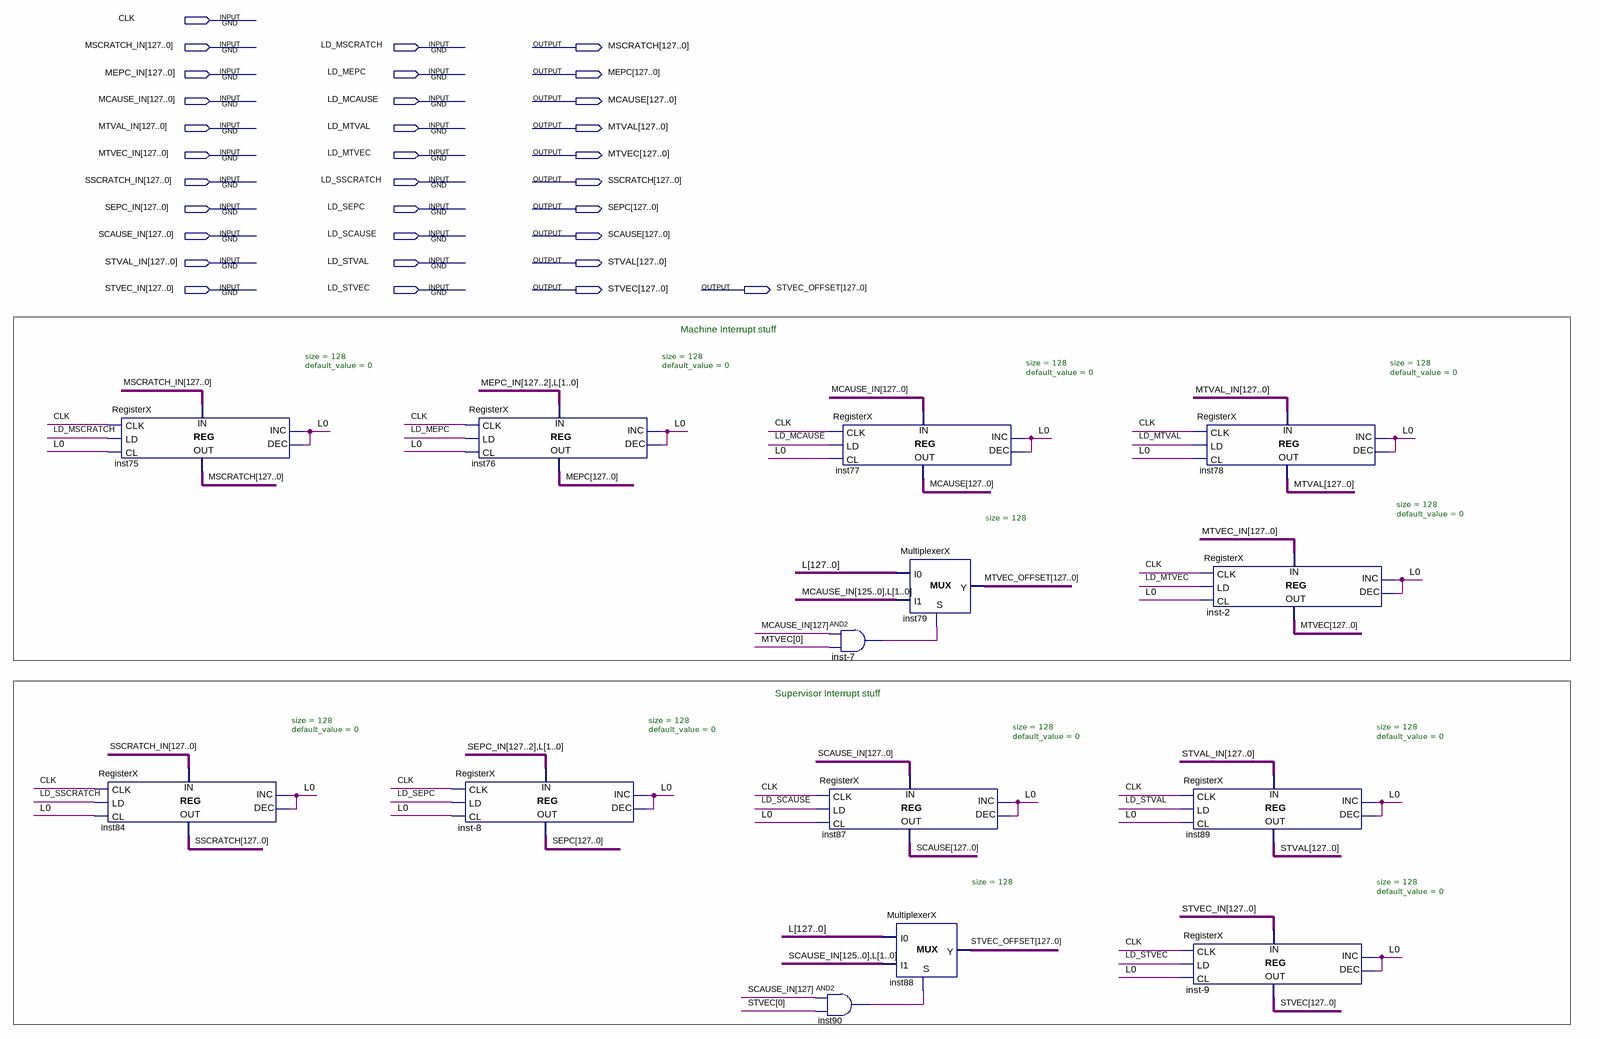
[diagram p0: schematic sheet]
// Quartus schematic Core_IntStatus.bdf as structural Verilog: 14 symbols, 32 pins
module Core_IntStatus (
  input  CLK,
  input  [127:0] MSCRATCH_IN,
  input  LD_MSCRATCH,
  input  [127:0] MEPC_IN,
  input  LD_MEPC,
  input  [127:0] MCAUSE_IN,
  input  LD_MCAUSE,
  input  [127:0] MTVAL_IN,
  input  LD_MTVAL,
  input  [127:0] MTVEC_IN,
  input  LD_MTVEC,
  input  [127:0] SSCRATCH_IN,
  input  LD_SSCRATCH,
  input  [127:0] SEPC_IN,
  input  LD_SEPC,
  input  [127:0] SCAUSE_IN,
  input  LD_SCAUSE,
  input  [127:0] STVAL_IN,
  input  LD_STVAL,
  input  [127:0] STVEC_IN,
  input  LD_STVEC,
  output [127:0] MSCRATCH,
  output [127:0] MEPC,
  output [127:0] MCAUSE,
  output [127:0] MTVAL,
  output [127:0] MTVEC,
  output [127:0] SSCRATCH,
  output [127:0] SEPC,
  output [127:0] SCAUSE,
  output [127:0] STVAL,
  output [127:0] STVEC,
  output [127:0] STVEC_OFFSET
);

  wire inst90_out, inst_7_out;
  wire [127:0] L, MTVEC_OFFSET;

  RegisterX #(.size(128), .default_value(0)) inst75 (
    .CLK(CLK), .LD(LD_MSCRATCH), .CL(L[0]), .INC(L[0]), .DEC(L[0]), .DATA_IN(MSCRATCH_IN), .DATA_OUT(MSCRATCH));
  RegisterX #(.size(128), .default_value(0)) inst84 (
    .CLK(CLK), .LD(LD_SSCRATCH), .CL(L[0]), .INC(L[0]), .DEC(L[0]), .DATA_IN(SSCRATCH_IN), .DATA_OUT(SSCRATCH));
  RegisterX #(.size(128), .default_value(0)) inst76 (
    .CLK(CLK), .LD(LD_MEPC), .CL(L[0]), .INC(L[0]), .DEC(L[0]), .DATA_IN({MEPC_IN[127:2], L[1:0]}),
    .DATA_OUT(MEPC));
  RegisterX #(.size(128), .default_value(0)) \inst-8  (
    .CLK(CLK), .LD(LD_SEPC), .CL(L[0]), .INC(L[0]), .DEC(L[0]), .DATA_IN({SEPC_IN[127:2], L[1:0]}),
    .DATA_OUT(SEPC));
  RegisterX #(.size(128), .default_value(0)) inst87 (
    .CLK(CLK), .LD(LD_SCAUSE), .CL(L[0]), .INC(L[0]), .DEC(L[0]), .DATA_IN(SCAUSE_IN), .DATA_OUT(SCAUSE));
  and inst90 (inst90_out, SCAUSE_IN[127], STVEC[0]);
  RegisterX #(.size(128), .default_value(0)) inst77 (
    .CLK(CLK), .LD(LD_MCAUSE), .CL(L[0]), .INC(L[0]), .DEC(L[0]), .DATA_IN(MCAUSE_IN), .DATA_OUT(MCAUSE));
  and \inst-7  (inst_7_out, MCAUSE_IN[127], MTVEC[0]);
  MultiplexerX #(.size(128)) inst79 (.S(inst_7_out), .I0(L), .I1({MCAUSE_IN[125:0], L[1:0]}), .Y(MTVEC_OFFSET));
  MultiplexerX #(.size(128)) inst88 (.S(inst90_out), .I0(L), .I1({SCAUSE_IN[125:0], L[1:0]}), .Y(STVEC_OFFSET));
  RegisterX #(.size(128), .default_value(0)) inst78 (
    .CLK(CLK), .LD(LD_MTVAL), .CL(L[0]), .INC(L[0]), .DEC(L[0]), .DATA_IN(MTVAL_IN), .DATA_OUT(MTVAL));
  RegisterX #(.size(128), .default_value(0)) inst89 (
    .CLK(CLK), .LD(LD_STVAL), .CL(L[0]), .INC(L[0]), .DEC(L[0]), .DATA_IN(STVAL_IN), .DATA_OUT(STVAL));
  RegisterX #(.size(128), .default_value(0)) \inst-9  (
    .CLK(CLK), .LD(LD_STVEC), .CL(L[0]), .INC(L[0]), .DEC(L[0]), .DATA_IN(STVEC_IN), .DATA_OUT(STVEC));
  RegisterX #(.size(128), .default_value(0)) \inst-2  (
    .CLK(CLK), .LD(LD_MTVEC), .CL(L[0]), .INC(L[0]), .DEC(L[0]), .DATA_IN(MTVEC_IN), .DATA_OUT(MTVEC));

  // Notes on the sheet:
  //   Machine Interrupt stuff
  //   Supervisor Interrupt stuff
endmodule
